# EAGLE design motor_connector_board (EAGLE 8.5.2)
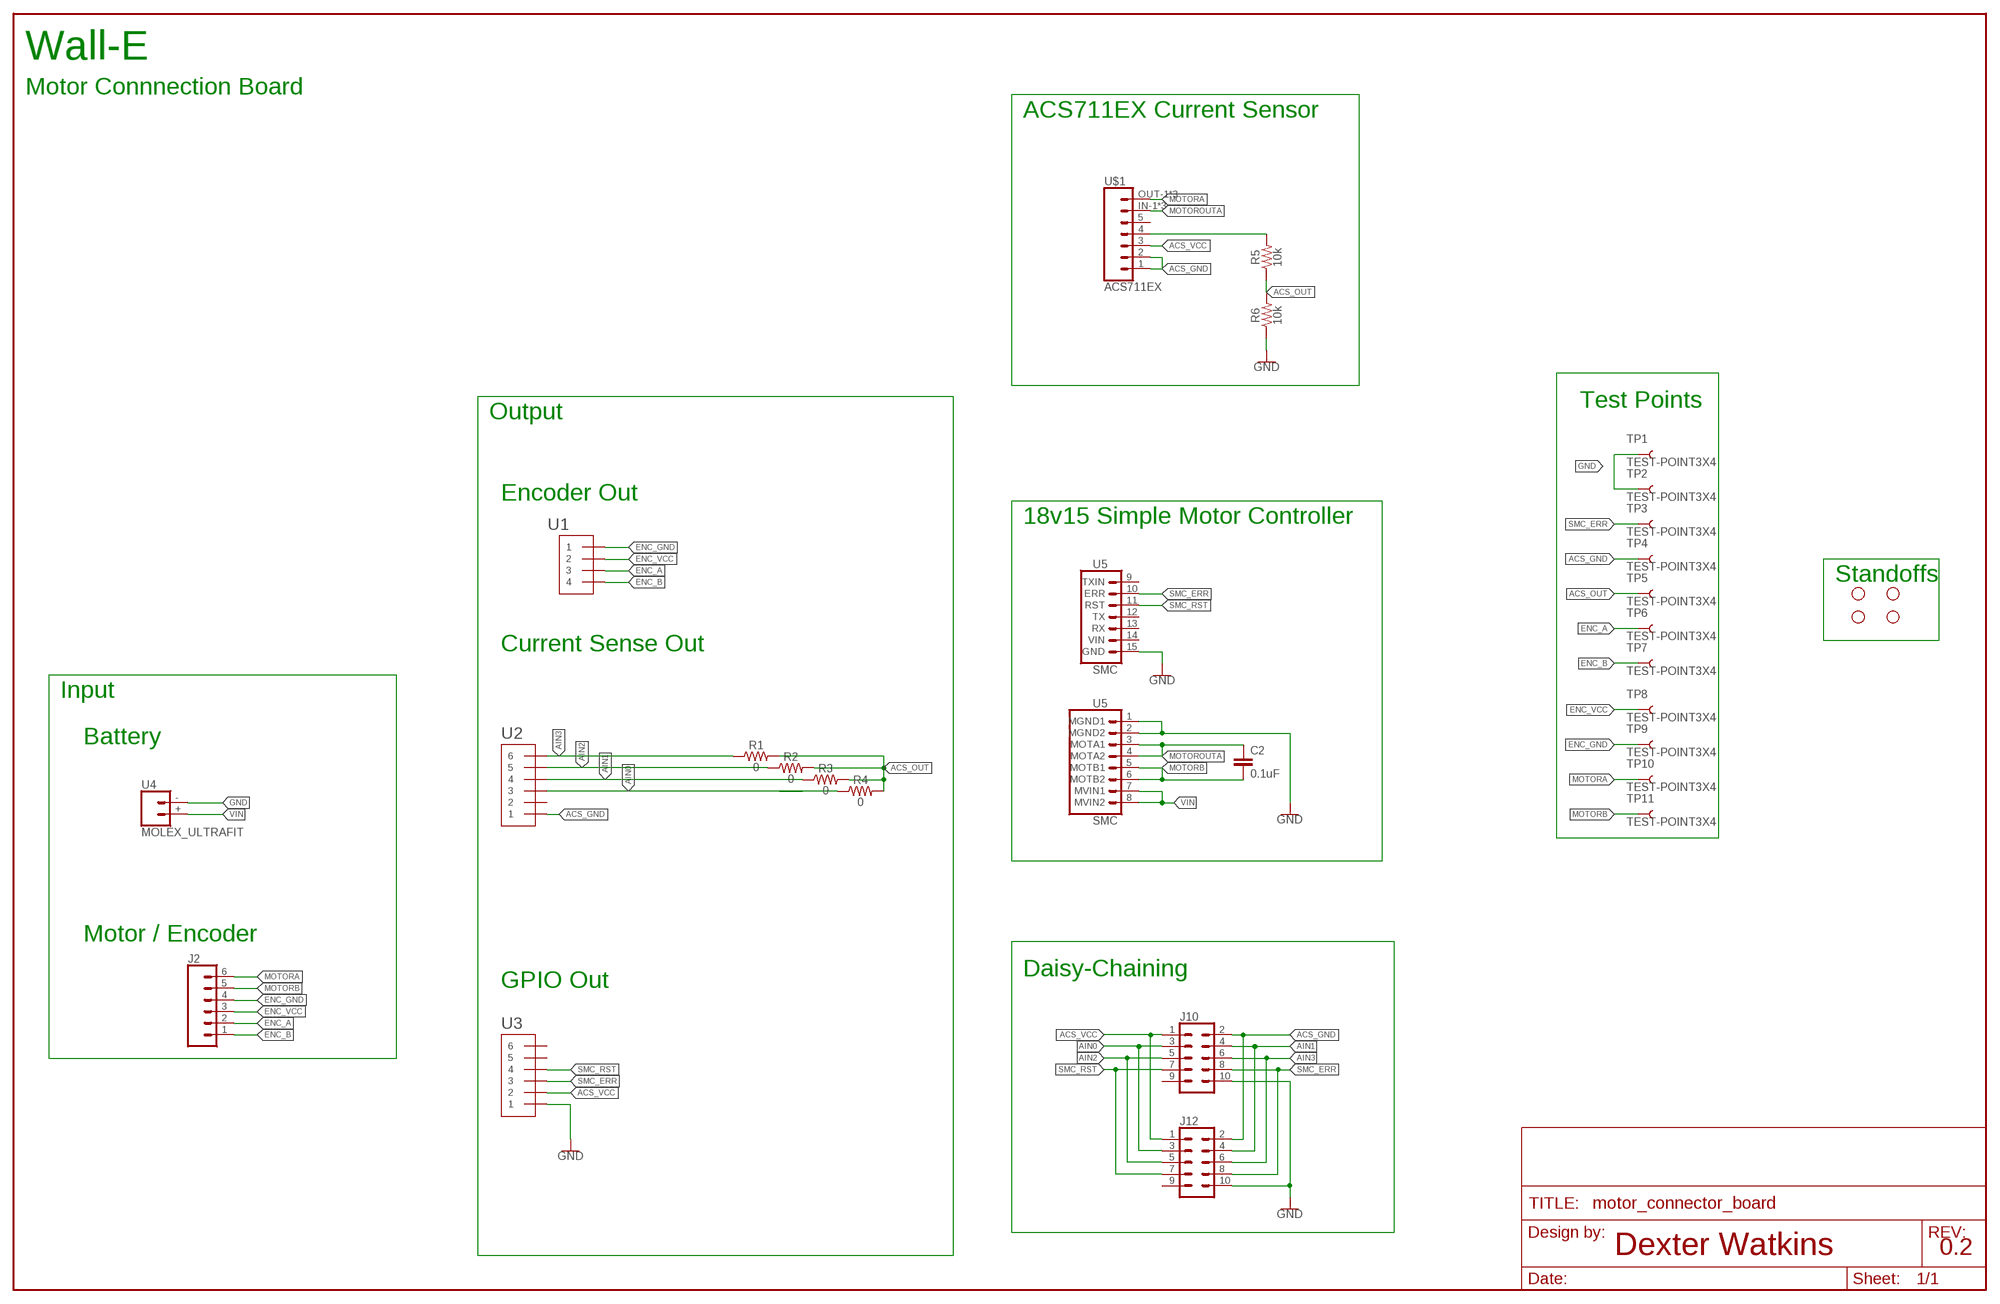
[diagram p0: schematic, sheet 1]

## Parts
C2  0.1uF  1.0NF/1000PF-0603-50V-10%  [0603]
FRAME1  FRAME-LEDGER  [CREATIVE_COMMONS]
H1  STAND-OFF  [STAND-OFF]
H2  STAND-OFF  [STAND-OFF]
H3  STAND-OFF  [STAND-OFF]
H4  STAND-OFF  [STAND-OFF]
J2  CONN_06LONGPADS  [1X06_LONGPADS]
J10  CONN_05X2SHD_LOCK  [2X5-SHROUDED_LOCK]
J12  CONN_05X2SHD_LOCK  [2X5-SHROUDED_LOCK]
R1  0  0OHM-0603-1/10W-5%  [0603]
R2  0  0OHM-0603-1/10W-5%  [0603]
R3  0  0OHM-0603-1/10W-5%  [0603]
R4  0  0OHM-0603-1/10W-5%  [0603]
R5  10k  10KOHM-0603-1/10W-1%  [0603]
R6  10k  10KOHM-0603-1/10W-1%  [0603]
TP1  TEST-POINT3X4  [PAD.03X.04]
TP2  TEST-POINT3X4  [PAD.03X.04]
TP3  TEST-POINT3X4  [PAD.03X.04]
TP4  TEST-POINT3X4  [PAD.03X.04]
TP5  TEST-POINT3X4  [PAD.03X.04]
TP6  TEST-POINT3X4  [PAD.03X.04]
TP7  TEST-POINT3X4  [PAD.03X.04]
TP8  TEST-POINT3X4  [PAD.03X.04]
TP9  TEST-POINT3X4  [PAD.03X.04]
TP10  TEST-POINT3X4  [PAD.03X.04]
TP11  TEST-POINT3X4  [PAD.03X.04]
U1  JST_SH_4  [JST_SH_4_SMD]
U2  JST_SH_6  [JST_SH_6]
U3  JST_SH_6  [JST_SH_6]
U4  MOLEX_ULTRAFIT  [MOLEX_ULTRAFIT-2CKT]
U5  SMC  [SMC]
U$1  ACS711EX  [ACS_CURRENT_SENSOR]

## Nets
ACS_3.3OUT: R5.2 U$1.4
ACS_GND: J10.2 J12.2 TP4.P$1 U2.1 U$1.1 U$1.2
ACS_OUT: R1.2 R2.2 R3.2 R4.2 R5.1 R6.2 TP5.P$1
ACS_VCC: J10.1 J12.1 U3.2 U$1.3
AIN0: J10.3 J12.3 R4.1 U2.3
AIN1: J10.4 J12.4 R3.1 U2.4
AIN2: J10.5 J12.5 R2.1 U2.5
AIN3: J10.6 J12.6 R1.1 U2.6
ENC_A: J2.2 TP6.P$1 U1.3
ENC_B: J2.1 TP7.P$1 U1.4
ENC_GND: J2.4 TP9.P$1 U1.1
ENC_VCC: J2.3 TP8.P$1 U1.2
GND: J10.10 J12.10 R6.1 TP1.P$1 TP2.P$1 U3.1 U4.- U5.1(MGND1) U5.2(MGND2) U5.15(GND)
MOTORA: J2.6 TP10.P$1 U$1.OUT-1 U$1.OUT-2 U$1.OUT-3
MOTORB: C2.2 J2.5 TP11.P$1 U5.5(MOTB1) U5.6(MOTB2)
MOTOROUTA: C2.1 U5.3(MOTA1) U5.4(MOTA2) U$1.IN-1 U$1.IN-2 U$1.IN-3
SMC_ERR: J10.8 J12.8 TP3.P$1 U3.3 U5.10(ERR)
SMC_RST: J10.7 J12.7 U3.4 U5.11(RST)
VIN: U4.+ U5.7(MVIN1) U5.8(MVIN2)
Unconnected: J10.9 J12.9 U2.2 U3.5 U3.6 U5.9(TXIN) U5.12(TX) U5.13(RX) U5.14(VIN) U$1.5

## Notes on the sheet
- Wall-E
- Motor Connnection Board
- ACS711EX Current Sensor
- Test Points
- Output
- Encoder Out
- 18v15 Simple Motor Controller
- Standoffs
- Current Sense Out
- Input
- Battery
- Motor / Encoder
- Daisy-Chaining
- GPIO Out
- Dexter Watkins | 0.2

## Library data of the parts
C2 = SparkFun-Capacitors:1.0NF/1000PF: 1nF/1,000pF ceramic capacitors A capacitor is a passive two-terminal electrical component used to store electrical energy temporarily in an electric field.; PROD_ID: CAP-07886; VALUE: 1nF
FRAME1 = SparkFun-Aesthetics:FRAME-LEDGER: Schematic Frame - Ledger Standard 11x14 US Ledger frame
H1-H4 = SparkFun-Hardware:STAND-OFF: Stand Off Drill holes for mechanically mounting via screws, standoffs, etc. Note: Use the keepout ring to avoid running the screw head into surrounding components. Variant Overviews STAND-OFF - Mechanical footprint for a #4 phillips button head screw. STAND-OFF-TIGHT - Mechanical footprint for a #4 phillips button head screw, Example SparkFun Products Screw - Phillips Head (1/4", 4-40, 10 pack) <https://www.sparkfun.com/products/10453> (PRT-10453) Screw - Phillips Head (1/2", 4-40, 10 pack) <https://www.sparkfun.com/products/10452> (PRT-10452) Screw - Phillips Head (3/4", 4-40, 10 pack) <https://www.sparkfun.com/products/10451> (PRT-10451) Screw - Phillips Head (1", 4-40, 10 pack) <https://www.sparkfun.com/products/10450> (PRT-10450)
J2 = SparkFun-Connectors:CONN_06: Multi connection point. Often used as Generic Header-pin footprint for 0.1 inch spaced/style header connections On any of the 0.1 inch spaced packages, you can populate with these: Break Away Headers - Straight <https://www.sparkfun.com/products/116> (PRT-00116) Break Away Male Headers - Right Angle <https://www.sparkfun.com/products/553> (PRT-00553) Female Headers <https://www.sparkfun.com/products/115> (PRT-00115) Break Away Headers - Machine Pin <https://www.sparkfun.com/products/117> (PRT-00117) Break Away Female Headers - Swiss Machine Pin <https://www.sparkfun.com/products/743> (PRT-00743) Arduino Stackable Header - 6 Pin <https://www.sparkfun.com/products/9280> (PRT-09280) For SCREWTERMINALS and SPRING TERMINALS visit here: Screw Terimnals on SparkFun.com <https://www.sparkfun.com/search/results?term=Screw+Terminals> (5mm/3.5mm/2.54mm spacing) This device is also useful as a general connection point to wire up your design to another part of your project. Our various solder wires solder well into these plated through hole pads. Hook-Up Wire - Assortment (Stranded, 22 AWG) <https://www.sparkfun.com/products/11375> (PRT-11375) Hook-Up Wire - Assortment (Solid Core, 22 AWG) <https://www.sparkfun.com/products/11367> (PRT-11367) View the entire wire category on our website here <https://www.sparkfun.com/categories/141>
J10 J12 = SparkFun-Connectors:CONN_05X2: Multi connection point. Often used as Generic Header-pin footprint for 0.1 inch spaced/style header connections For AVR SPI programming port, see special device with nice symbol: "AVR_SPI_PROG_5x2.dev" You can populate with any combo of single row headers, but if you'd like an exact match, check these: 2x5 AVR ICSP Male Header <https://www.sparkfun.com/products/778> (PRT-00778) 2x5 Pin Shrouded Header <https://www.sparkfun.com/products/8506> (PRT-08506) On any of the 0.1 inch spaced packages, you can populate with these: Break Away Headers - Straight <https://www.sparkfun.com/products/116> (PRT-00116) Break Away Male Headers - Right Angle <https://www.sparkfun.com/products/553> (PRT-00553) Female Headers <https://www.sparkfun.com/products/115> (PRT-00115) Break Away Headers - Machine Pin <https://www.sparkfun.com/products/117> (PRT-00117) Break Away Female Headers - Swiss Machine Pin <https://www.sparkfun.com/products/743> (PRT-00743) Special note: the shrouded connector mates well with our 5x2 ribbon cables: 2x5 Pin IDC Ribbon Cable <https://www.sparkfun.com/products/8535> (PRT-08535); PROD_ID: CONN-08671; SF_ID: PRT-08506
R1-R4 = SparkFun-Resistors:0OHM: 0Ω resistor A resistor is a passive two-terminal electrical component that implements electrical resistance as a circuit element. Resistors act to reduce current flow, and, at the same time, act to lower voltage levels within circuits. - Wikipedia; PROD_ID: RES-08609
R5 R6 = SparkFun-Resistors:10KOHM: 10kΩ resistor A resistor is a passive two-terminal electrical component that implements electrical resistance as a circuit element. Resistors act to reduce current flow, and, at the same time, act to lower voltage levels within circuits. - Wikipedia; PROD_ID: RES-00824
TP1-TP11 = SparkFun-Connectors:TEST-POINT: SparkFun Test Points Bare copper test points for troubleshooting or In-Circuit-Testing. These are used by our Production team for verifying production board runs using pogo-pins on test beds. SparkFun Products: SparkFun LSM9DS1 Breakout <https://www.sparkfun.com/products/13284> SparkFun PSOC <https://www.sparkfun.com/products/13714> SparkFun Load Cell Amplifier <https://www.sparkfun.com/products/13879>
U1 = Strawson_Eagle_Lib:JST_SH_4
U2 U3 = Strawson_Eagle_Lib:JST_SH_6
U4 = WallE_Motor_Board:MOLEX_ULTRAFIT
U5 = WallE_Motor_Board:SMC
U$1 = WallE_Motor_Board:ACS711EX

## Net classes
0 default: width 0.152 mm, drill 0.254 mm, clearance 0.152 mm
1 ground: width 0.152 mm, drill 0.254 mm, clearance 0.152 mm
3 power: width 0.152 mm, drill 0.254 mm, clearance 0.152 mm

## Board
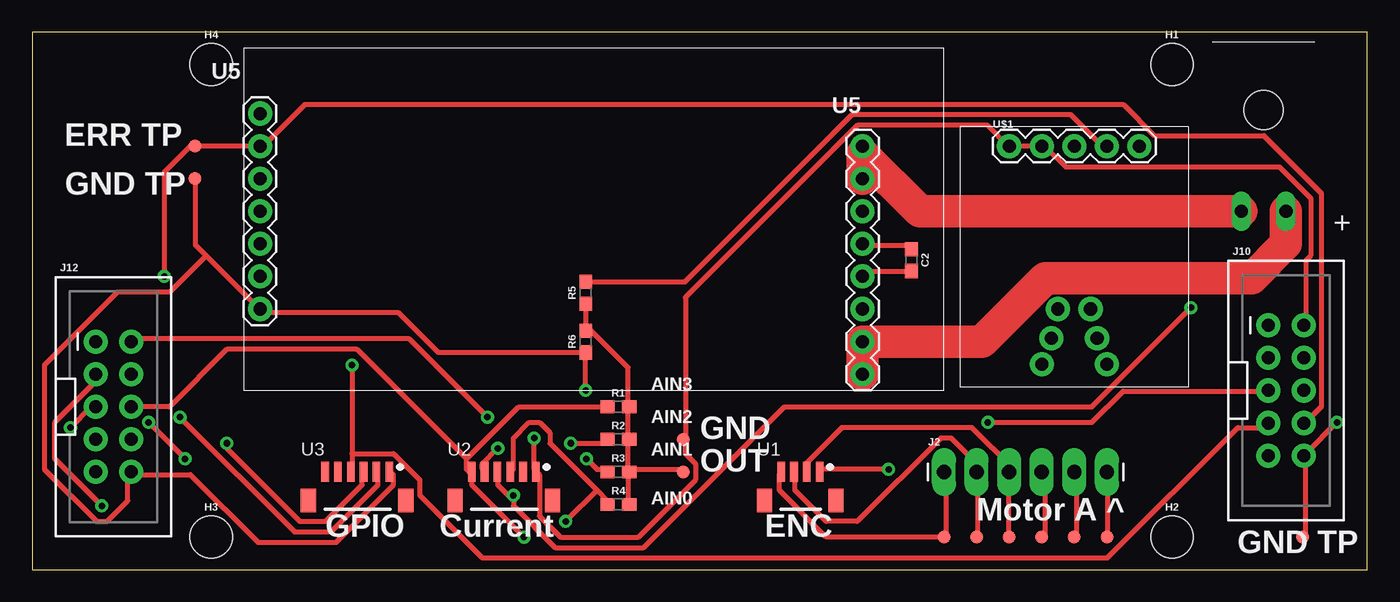
[diagram p1: board, top side]
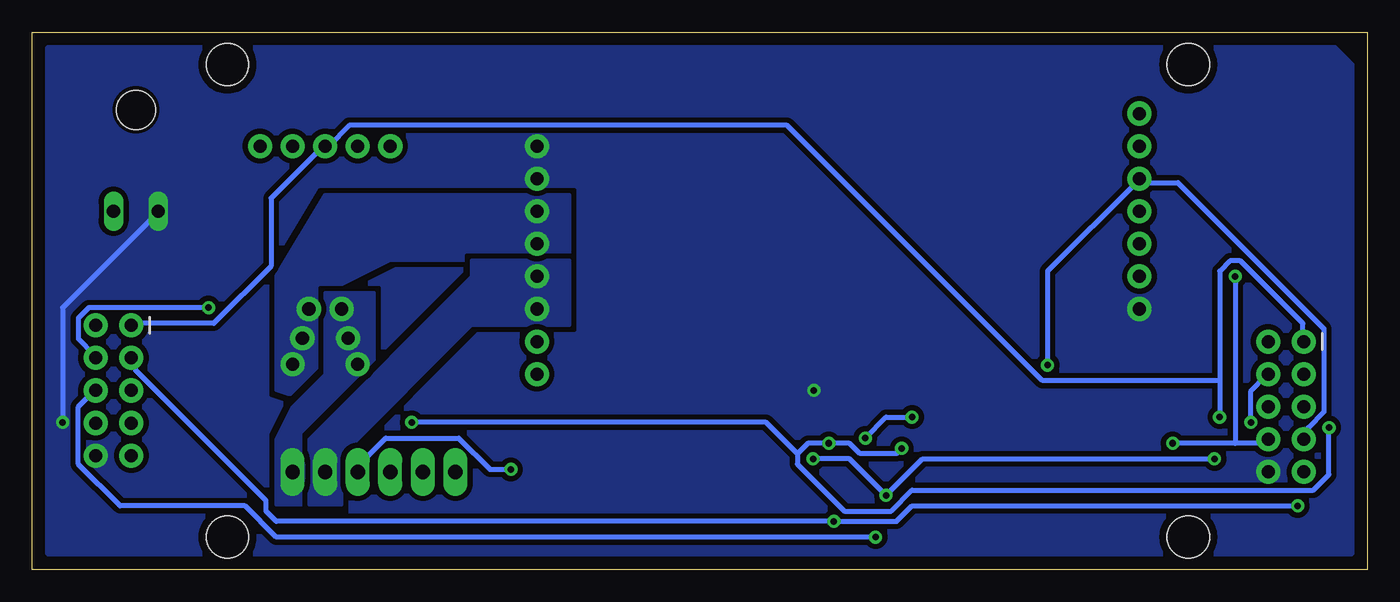
[diagram p2: board, bottom side, seen from below]

Size 104.14 x 41.91 mm. Coordinates in mm from the lower left corner, seen from the top.
Outline: 0,0 104.14,0 104.14,41.91 0,41.91 0,0
Copper layers (1*16): Top 0.035mm / dielectric 1.5mm / Bottom 0.035mm
Design rules "SparkFun-2-layer-STANDARD *": minimum track width 16mil, minimum drill 20mil, track to track 16mil, track to pad 8mil, pad to pad 8mil, via to via 10mil, smd to smd 8mil, copper to edge 8mil, drill to drill 8mil, minimum pad ring 10mil, minimum via ring 10mil, stop-mask expansion 4mil, vias tented up to drill 25mil, thermal gap 10mil

### Footprints (pad centres in the part's own frame; a part is rotated, then mirrored left to right if it is on the bottom)
0603 = smd 1.1 x 1: 1 -0.85,0; 2 0.85,0
STAND-OFF = hole 3.302: 0,0
1X06_LONGPADS = drill 1.118 pad 1.88 long: 1 0,0; 2 2.54,0; 3 5.08,0; 4 7.62,0; 5 10.16,0; 6 12.7,0
2X5-SHROUDED_LOCK = drill 1.016 pad 1.88: 1 -1.397,5.08; 2 1.397,5.08; 3 -1.397,2.54; 4 1.397,2.54; 5 -1.397,0; 6 1.397,0; 7 -1.397,-2.54; 8 1.397,-2.54; 9 -1.397,-5.08; 10 1.397,-5.08
PAD.03X.04 = smd 1.016 x 1.016: P$1 0,0
JST_SH_4_SMD = smd 0.6 x 1.55: 1 0.46,1.27; 2 -0.54,1.27; 3 -1.54,1.27; 4 -2.54,1.27 | smd 1.2 x 1.8: P$1 -3.84,-0.955; P$2 1.728,-0.955
JST_SH_6 = smd 0.6 x 1.55: 1 5,0; 2 4,0; 3 3,0; 4 2,0; 5 1,0; 6 0,0 | smd 1.2 x 1.8: P$1 -1.3,-2.225; P$2 6.3,-2.225
MOLEX_ULTRAFIT-2CKT = drill 1.02 long: + 0,0; - 3.5,0 | hole 3.05: 1.75,-7.91
SMC = drill 1.016 pad 1.88: 1 0,0; 2 0,-2.54; 3 0,-5.08; 4 0,-7.62; 5 0,-10.16; 6 0,-12.7; 7 0,-15.24; 8 0,-17.78; 9 -46.99,2.54; 10 -46.99,0; 11 -46.99,-2.54; 12 -46.99,-5.08; 13 -46.99,-7.62; 14 -46.99,-10.16; 15 -46.99,-12.7
ACS_CURRENT_SENSOR = drill 1.016 pad 1.88: 1 0,-10.16; 2 0,-7.62; 3 0,-5.08; 4 0,-2.54; 5 0,0; IN-1 12.7,-3.81; IN-2 14.986,-3.302; IN-3 17.018,-2.54; OUT-1 12.7,-6.35; OUT-2 14.986,-6.858; OUT-3 17.018,-7.62

### Placement (x,y rotation side)
C2  68.58,24.13 270 top
FRAME1  11.43,2.54 0 top
H1  88.9,39.37 0 top
H2  88.9,2.54 0 top
H3  13.97,2.54 0 top
H4  13.97,39.37 0 top
J2  71.12,7.62 0 top
J10  97.79,13.97 0 top
J12  6.35,12.7 0 top
R1  45.72,12.7 0 top
R2  45.72,10.16 0 top
R3  45.72,7.62 0 top
R4  45.72,5.08 0 top
R5  43.18,21.59 90 top
R6  43.18,17.78 90 top
TP1  12.7,30.48 0 top
TP2  99.06,2.54 0 top
TP3  12.7,33.02 0 top
TP4  50.8,10.16 0 top
TP5  50.8,7.62 0 top
TP6  73.66,2.54 0 top
TP7  71.12,2.54 0 top
TP8  76.2,2.54 0 top
TP9  78.74,2.54 0 top
TP10  83.82,2.54 0 top
TP11  81.28,2.54 0 top
U1  60.96,6.35 0 top
U2  34.29,7.62 0 top
U3  22.86,7.62 0 top
U4  97.79,27.94 180 top
U5  64.77,33.02 0 top
U$1  86.36,33.02 270 top

### Tracks (layer width: path | path; a pad name or v marks a point on that pad's centre or on a via)
ACS_3.3OUT
  Top 0.406: U$1.4 83.46,33.02 81.03,35.46 63.96,35.46 50.94,22.44 R5.2
ACS_GND  (via drill 0.51)
  Top 0.406: J10.2 99.31,19.2 99.31,24.08 99.72,24.49 99.72,28.96 97.28,31.39 80.62,31.39 78.99,33.02 U$1.2 U$1.1 76.15,33.02 74.52,34.65 64.36,34.65 50.95,21.23 50.95,10.26 TP4.P$1 50.95,9.86 50.95,9.04 51.77,8.23 51.77,7.01 47.3,2.54 41.2,2.54 39.57,4.17 39.57,7.42 U2.1 39.17,7.82 v39.17,10.26 | v35.51,11.89 29.41,17.98 7.87,17.98 J12.2
  Bottom 0.406: v35.51,11.89 37.54,11.89 v39.17,10.26
ACS_OUT
  Top 0.406: TP5.P$1 50.55,7.82 46.89,7.82 R3.2 | R4.2 46.48,5.38 46.48,7.42 R3.2 | R3.2 46.48,7.82 46.48,9.86 R2.2 46.48,10.26 46.48,12.7 | 46.48,12.7 46.48,15.75 43.18,19.05 | 46.48,12.7 R1.2 | R5.1 43.18,19.05 | 43.18,19.05 R6.2
ACS_VCC  (via drill 0.51)
  Top 0.406: v11.53,11.89 20.47,2.95 23.32,2.95 26.98,6.6 26.98,7.42 U3.2
  Bottom 0.406: J10.1 96.06,19.2 89.97,19.2 85.5,23.67 85.5,28.96 81.43,33.02 U$1.3 81.03,33.02 79.4,34.65 45.26,34.65 25.35,14.73 11.53,14.73 | 11.53,14.73 11.53,23.27 10.72,24.08 9.91,24.08 5.03,19.2 5.03,17.98 J12.1 | 11.53,14.73 v11.53,11.89
AIN0  (via drill 0.51)
  Top 0.406: 44.04,6.2 40.39,9.86 40.39,10.67 39.57,11.48 38.76,11.48 37.54,10.26 37.54,7.82 U2.3 | 44.04,6.2 44.86,5.38 R4.1 | v5.44,4.98 1.78,8.64 1.78,11.48 4.62,14.33 4.62,15.14 J12.3 | 44.04,6.2 v41.61,3.76
  Bottom 0.406: v5.44,4.98 35.51,4.98 36.73,3.76 v41.61,3.76 85.09,3.76 85.9,4.57 85.9,5.38 96.06,15.55 96.06,16.36 J10.3
AIN1  (via drill 0.51)
  Top 0.406: v43.23,8.64 44.04,7.82 44.86,7.82 R3.1 | U2.4 36.32,7.42 36.32,6.6 37.13,5.79 v37.54,5.79 37.54,4.98 40.79,1.73 47.7,1.73 58.67,12.7 82.65,12.7 v90.37,20.42 | v11.94,8.64 v9.09,11.48
  Bottom 0.406: v43.23,8.64 40.39,8.64 v37.54,5.79 34.7,8.64 v11.94,8.64 | v9.09,11.48 9.09,13.92 7.87,15.14 J12.4 | v90.37,20.42 99.72,20.42 100.53,19.61 100.53,17.98 99.31,16.76 J10.4
AIN2  (via drill 0.51)
  Top 0.406: v42.01,9.86 44.86,9.86 R2.1 | v36.32,9.45 35.1,8.23 35.1,7.82 U2.5 | v3,11.07 4.62,12.7 J12.5 | v74.52,11.48 82.65,11.48 85.09,13.92 96.06,13.92 J10.5
  Bottom 0.406: v36.32,9.45 36.73,9.04 39.57,9.04 40.39,9.86 v42.01,9.86 43.64,9.86 44.45,9.04 | v3,11.07 3,7.42 4.22,6.2 35.51,6.2 37.13,4.57 40.79,4.57 44.45,8.23 44.45,9.04 | v74.52,11.48 46.89,11.48 44.45,9.04
AIN3  (via drill 0.51)
  Top 0.406: R1.1 37.95,12.7 33.88,8.64 | 33.88,8.64 33.88,7.82 34.29,7.42 | J12.6 10.72,12.7 15.19,17.17 25.35,17.17 33.88,8.64 | v38.35,2.54 34.29,6.6 34.29,7.42 | 34.29,7.42 U2.6
  Bottom 0.406: v38.35,2.54 85.09,2.54 87.53,4.98 97.28,4.98 100.53,8.23 100.53,12.7 99.31,13.92 J10.6
ENC_A
  Top 0.406: TP6.P$1 73.71,2.54 73.71,7.42 J2.2 73.3,7.82 73.3,8.64 71.68,10.26 70.87,10.26 64.36,3.76 61.92,3.76 59.49,6.2 59.49,7.42 U1.3
ENC_B
  Top 0.406: J2.1 71.27,7.42 71.27,2.54 TP7.P$1 61.92,2.54 58.27,6.2 58.27,7.42 U1.4
ENC_GND  (via drill 0.51)
  Top 0.406: TP9.P$1 78.99,2.54 78.99,7.42 J2.4 | v66.8,7.82 61.52,7.82 U1.1
  Bottom 0.406: v66.8,7.82 68.43,7.82 70.87,10.26 76.56,10.26 78.99,7.82 J2.4
ENC_VCC
  Top 0.406: TP8.P$1 76.15,2.54 76.15,7.42 J2.3 76.56,7.82 73.3,11.07 63.14,11.07 60.3,8.23 60.3,7.82 U1.2
GND  (via drill 0.51)
  Top 0.406: U3.1 27.79,7.82 28.19,7.42 28.19,6.6 23.72,2.13 17.63,2.13 12.34,7.42 7.87,7.42 J12.10 7.47,7.42 7.47,5.38 5.84,3.76 5.03,3.76 0.96,7.82 0.96,15.95 6.66,21.64 10.72,21.64 13.56,24.49 | 13.56,24.49 17.63,20.42 U5.15 18.03,20.02 28.6,20.02 31.69,16.93 R6.1 v43.18,13.97 | 13.56,24.49 12.75,25.3 12.75,30.18 TP1.P$1 | TP2.P$1 99.31,2.54 99.31,8.64 J10.10 99.31,9.04 v101.75,11.48
  Top 2.54: U4.- 69.22,27.94 64.77,32.39 U5.2
  Bottom 0.406: v101.75,11.48 101.75,20.42 94.44,27.74 U4.-
  pour Bottom (isolate 0.305, rank 6, no thermals): 102.87,40.64 102.87,1.27 1.27,1.27 1.27,39.37 2.54,40.64
MOTORA
  Top 0.406: TP10.P$1 83.87,2.54 83.87,7.42 J2.6
  pour Bottom (isolate 0.305, rank 4, no thermals): 81.28,21.59 77.47,21.59 77.47,15.24 82.55,10.16 82.55,5.08 85.09,5.08 85.09,10.16 83.82,12.7 81.28,15.24
MOTORB
  Top 0.406: TP11.P$1 81.43,2.54 81.43,7.42 J2.5 | U5.5 65.18,23.27 68.43,23.27 C2.2
  pour Bottom (isolate 0.305, rank 3, no thermals): 69.85,24.13 62.23,24.13 62.23,19.05 69.85,19.05 80.01,8.89 80.01,5.08 82.55,5.08 82.55,10.16 69.85,22.86
MOTOROUTA
  Top 0.406: C2.1 68.43,25.3 64.77,25.3 U5.4
  pour Bottom (isolate 0.305, rank 5, no thermals): 62.23,29.21 62.23,24.13 76.2,24.13 81.28,21.59 81.28,12.7 85.09,13.97 85.09,22.86 81.28,29.21
SMC_ERR  (via drill 0.51)
  Top 0.406: v15.19,9.86 15.19,9.45 20.88,3.76 22.91,3.76 25.76,6.6 25.76,7.42 U3.3 | J10.8 99.31,11.48 100.53,12.7 100.53,29.36 96.06,33.83 87.53,33.83 85.09,36.27 21.28,36.27 18.03,33.02 U5.10 TP3.P$1 12.34,33.02 10.31,30.99 v10.31,22.86
  Bottom 0.406: 10.31,9.86 7.87,9.86 J12.8 | 10.31,9.86 v15.19,9.86 | v10.31,22.86 10.31,9.86
SMC_RST  (via drill 0.51)
  Top 0.406: v24.94,15.95 24.94,9.04 | 24.94,9.04 24.94,7.82 U3.4 | 24.94,9.04 28.19,9.04 30.23,7.01 30.23,5.79 35.1,0.91 83.87,0.91 94.03,11.07 96.06,11.07 J10.7
  Bottom 0.406: v24.94,15.95 24.94,23.27 18.03,30.18 U5.11 17.63,30.18 14.78,30.18 3.4,18.8 3.4,12.29 4.62,11.07 4.62,10.26 J12.7
VIN
  Top 2.54: U5.8 U5.7 74.06,17.78 79.01,22.73 95.12,22.73 97.79,25.4 U4.+

### Text on the board
tPlace: ERR TP | GND TP | AIN3 | AIN2 | GND | AIN1 | OUT | AIN0 | Motor A ^ | GPIO | Current | ENC | GND TP